# EAGLE design FATSC-DevKit_v10 (EAGLE 7.7.0)
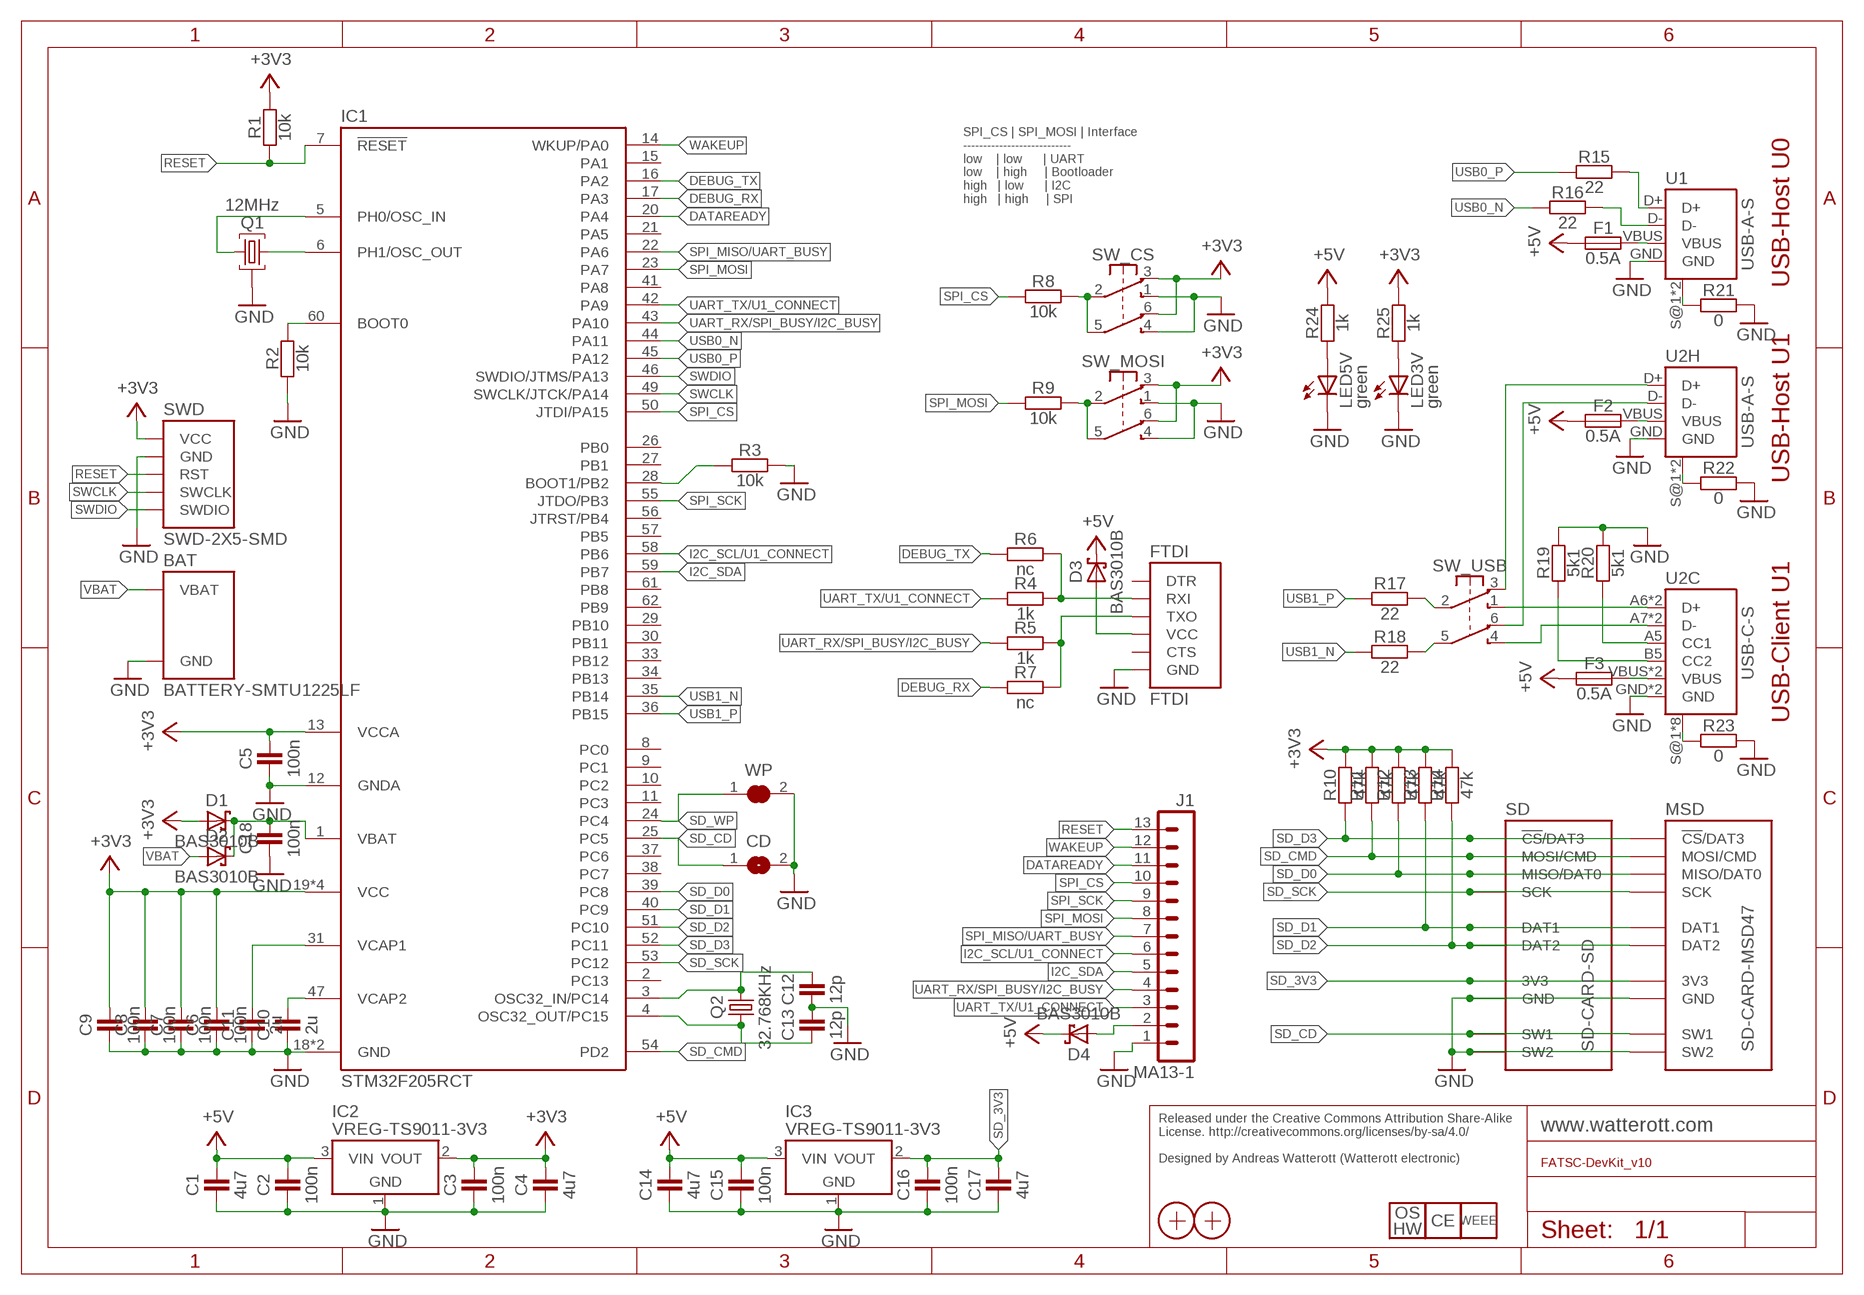
[diagram p0: schematic, sheet 1]

## Parts
BAT  BATTERY-SMTU1225LF  [BAT-SMTU1225LF]
C1  4u7  CAPACITOR-0603  [C0603]
C2  100n  CAPACITOR-0603  [C0603]
C3  100n  CAPACITOR-0603  [C0603]
C4  4u7  CAPACITOR-0603  [C0603]
C5  100n  CAPACITOR-0603  [C0603]
C6  100n  CAPACITOR-0603  [C0603]
C7  100n  CAPACITOR-0603  [C0603]
C8  100n  CAPACITOR-0603  [C0603]
C9  100n  CAPACITOR-0603  [C0603]
C10  2u  CAPACITOR-0603  [C0603]
C11  2u  CAPACITOR-0603  [C0603]
C12  12p  CAPACITOR-0603  [C0603]
C13  12p  CAPACITOR-0603  [C0603]
C14  4u7  CAPACITOR-0603  [C0603]
C15  100n  CAPACITOR-0603  [C0603]
C16  100n  CAPACITOR-0603  [C0603]
C17  4u7  CAPACITOR-0603  [C0603]
C18  100n  CAPACITOR-0603  [C0603]
CD  JUMPER2-0603-NC  [JUMPER2-0603_NC]
D1  BAS3010B  D_SCHOTTKY-SOD323  [SOD323]
D2  BAS3010B  D_SCHOTTKY-SOD323  [SOD323]
D3  BAS3010B  D_SCHOTTKY-SOD323  [SOD323]
D4  BAS3010B  D_SCHOTTKY-SOD323  [SOD323]
F1  0.5A  FUSE-0805  [C0805]
F2  0.5A  FUSE-0805  [C0805]
F3  0.5A  FUSE-0805  [C0805]
FTDI  FTDI  [FTDI]
IC1  STM32F205RCT  [LQFP64]
IC2  VREG-TS9011-3V3  [SOT23]
IC3  VREG-TS9011-3V3  [SOT23]
J1  MA13-1  [MA13-1]
LED3V  green  LED-0603  [C0603]
LED5V  green  LED-0603  [C0603]
LOGO7  LOGO_OSHW-4  [OSHW_4MM]
LOGO8  LOGO_CE-2  [CE_2MM]
LOGO9  LOGO_WEEE-4  [WEEE_4MM]
MSD  SD-CARD-MSD47  [SD_47309XXXX]
Q1  12MHz  CRYSTAL-RES-32  [CRYSTAL_32X13]
Q2  32.768KHz  CRYSTAL-ZM315  [CRYSTAL_ZM315]
R1  10k  RESISTOR-0603  [C0603]
R2  10k  RESISTOR-0603  [C0603]
R3  10k  RESISTOR-0603  [C0603]
R4  1k  RESISTOR-0603  [C0603]
R5  1k  RESISTOR-0603  [C0603]
R6  nc  RESISTOR-0603  [C0603]
R7  nc  RESISTOR-0603  [C0603]
R8  10k  RESISTOR-0603  [C0603]
R9  10k  RESISTOR-0603  [C0603]
R10  47k  RESISTOR-0603  [C0603]
R11  47k  RESISTOR-0603  [C0603]
R12  47k  RESISTOR-0603  [C0603]
R13  47k  RESISTOR-0603  [C0603]
R14  47k  RESISTOR-0603  [C0603]
R15  22  RESISTOR-0603  [C0603]
R16  22  RESISTOR-0603  [C0603]
R17  22  RESISTOR-0603  [C0603]
R18  22  RESISTOR-0603  [C0603]
R19  5k1  RESISTOR-0603  [C0603]
R20  5k1  RESISTOR-0603  [C0603]
R21  0  RESISTOR-0603  [C0603]
R22  0  RESISTOR-0603  [C0603]
R23  0  RESISTOR-0603  [C0603]
R24  1k  RESISTOR-0603  [C0603]
R25  1k  RESISTOR-0603  [C0603]
SD  SD-CARD-SD  [SD_SDBMF00915B0T2]
SW_CS  SW-2UM-CUS22B  [CUS22B]
SW_MOSI  SW-2UM-CUS22B  [CUS22B]
SW_USB  SW-2UM-CUS22B  [CUS22B]
SWD  SWD-2X5-SMD  [SWD-2X5_SMD]
U1  USB-A-S  [USB-A-S]
U2C  USB-C-S  [USB-C-S]
U2H  USB-A-S  [USB-A-S]
WP  JUMPER2-0603  [JUMPER2-0603]
X1  PASSER-07  [PASSER_07MM]
X2  PASSER-07  [PASSER_07MM]

## Nets
5VIN: D4.A J1.2
+3V3: C3.2 C4.2 C5.2 C6.2 C7.2 C8.2 C9.2 D1.A IC1.13(VCCA) IC1.19(VCC) IC1.32(VCC) IC1.48(VCC) IC1.64(VCC) IC2.2(VOUT) R1.2 R10.2 R11.2 R12.2 R13.2 R14.2 R25.2 SW_CS.3(NC1) SW_CS.6(NC2) SW_MOSI.3(NC1) SW_MOSI.6(NC2) SWD.VCC
+5V: C1.2 C2.2 C14.2 C15.2 D3.C D4.C F1.1 F2.1 F3.1 IC2.3(VIN) IC3.3(VIN) R24.2
BOOT0: IC1.60(BOOT0) R2.2
BOOT1: IC1.28(BOOT1/PB2) R3.1
CC1: R20.1 U2C.A5(CC1)
CC2: R19.1 U2C.B5(CC2)
CS: R8.2 SW_CS.2(C1) SW_CS.5(C2)
D0_N: R16.2 U1.D-
D0_P: R15.2 U1.D+
D1_N: R18.2 SW_USB.5(C2)
D1_P: R17.2 SW_USB.2(C1)
D1C_N: SW_USB.4(NO2) U2C.A7(D-) U2C.B7(D-)
D1C_P: SW_USB.1(NO1) U2C.A6(D+) U2C.B6(D+)
D1H_N: SW_USB.6(NC2) U2H.D-
D1H_P: SW_USB.3(NC1) U2H.D+
DATAREADY: IC1.20(PA4) J1.11
DEBUG_RX: IC1.17(PA3) R7.1
DEBUG_TX: IC1.16(PA2) R6.1
FTDI_VCC: D3.A FTDI.3-VCC(VCC)
GND: BAT.-(GND) C1.1 C2.1 C3.1 C4.1 C5.1 C6.1 C7.1 C8.1 C9.1 C10.1 C11.1 C12.1 C13.2 C14.1 C15.1 C16.1 C17.1 C18.1 CD.2 FTDI.1-GND(GND) IC1.12(GNDA) IC1.18(GND) IC1.63(GND) IC2.1(GND) IC3.1(GND) J1.1 LED3V.C LED5V.C MSD.GND MSD.GND@1(GND) MSD.GND@2(GND) MSD.SW2 Q1.GND R2.1 R3.2 R19.2 R20.2 R21.2 R22.2 R23.2 SD.GND@1(GND) SD.GND@2(GND) SD.GND@3(GND) SD.SW2 SW_CS.1(NO1) SW_CS.4(NO2) SW_MOSI.1(NO1) SW_MOSI.4(NO2) SWD.GND@1(GND) SWD.GND@2(GND) SWD.GND@3(GND) U1.GND U2C.GND U2C.GND2(GND) U2H.GND WP.2
I2C_SCL/U1_CONNECT: IC1.58(PB6) J1.6
I2C_SDA: IC1.59(PB7) J1.5
MOSI: R9.2 SW_MOSI.2(C1) SW_MOSI.5(C2)
N$1: LED5V.A R24.1
N$2: LED3V.A R25.1
OSC32I: C12.2 IC1.3(OSC32_IN/PC14) Q2.2
OSC32O: C13.1 IC1.4(OSC32_OUT/PC15) Q2.1
OSCI: IC1.5(PH0/OSC_IN) Q1.2
OSCO: IC1.6(PH1/OSC_OUT) Q1.1
RESET: IC1.7(!RESET) J1.13 R1.1 SWD.RST
RXI: FTDI.5-RXI(RXI) R4.2 R6.2
SD_3V3: C16.2 C17.2 IC3.2(VOUT) MSD.VCC(3V3) SD.VCC(3V3)
SD_CD: CD.1 IC1.25(PC5) MSD.SW1 SD.SW1
SD_CMD: IC1.54(PD2) MSD.MOSI(MOSI/CMD) R11.1 SD.MOSI(MOSI/CMD)
SD_D0: IC1.39(PC8) MSD.MISO(MISO/DAT0) R12.1 SD.MISO(MISO/DAT0)
SD_D1: IC1.40(PC9) MSD.DAT1 R13.1 SD.DAT1
SD_D2: IC1.51(PC10) MSD.DAT2 R14.1 SD.DAT2
SD_D3: IC1.52(PC11) MSD.CS(!CS!/DAT3) R10.1 SD.CS(!CS!/DAT3)
SD_SCK: IC1.53(PC12) MSD.SCK SD.SCK
SD_WP: IC1.24(PC4) WP.1
SPI_CS: IC1.50(JTDI/PA15) J1.10 R8.1
SPI_MISO/UART_BUSY: IC1.22(PA6) J1.7
SPI_MOSI: IC1.23(PA7) J1.8 R9.1
SPI_SCK: IC1.55(JTDO/PB3) J1.9
SU0: R21.1 U1.S@1(SHIELD) U1.S@2(SHIELD)
SU1C: R23.1 U2C.S@1(SHIELD) U2C.S@2(SHIELD) U2C.S@3(SHIELD) U2C.S@4(SHIELD) U2C.S@5(SHIELD) U2C.S@6(SHIELD) U2C.S@7(SHIELD) U2C.S@8(SHIELD)
SU1H: R22.1 U2H.S@1(SHIELD) U2H.S@2(SHIELD)
SWCLK: IC1.49(SWCLK/JTCK/PA14) SWD.SWCLK
SWDIO: IC1.46(SWDIO/JTMS/PA13) SWD.SWDIO
TXO: FTDI.4-TXO(TXO) R5.2 R7.2
UART_RX/SPI_BUSY/I2C_BUSY: IC1.43(PA10) J1.4 R5.1
UART_TX/U1_CONNECT: IC1.42(PA9) J1.3 R4.1
USB0_N: IC1.44(PA11) R16.1
USB0_P: IC1.45(PA12) R15.1
USB1_N: IC1.35(PB14) R18.1
USB1_P: IC1.36(PB15) R17.1
VB: C18.2 D1.C D2.C IC1.1(VBAT)
VBAT: BAT.+(VBAT) D2.A
VBUS_U0: F1.2 U1.VBUS
VBUS_U1C: F3.2 U2C.VBUS U2C.VBUS2(VBUS)
VBUS_U1H: F2.2 U2H.VBUS
VCAP1: C11.2 IC1.31(VCAP1)
VCAP2: C10.2 IC1.47(VCAP2)
WAKEUP: IC1.14(WKUP/PA0) J1.12
Unconnected: FTDI.2-CTS(CTS) FTDI.6-DTR(DTR) IC1.2(PC13) IC1.8(PC0) IC1.9(PC1) IC1.10(PC2) IC1.11(PC3) IC1.15(PA1) IC1.21(PA5) IC1.26(PB0) IC1.27(PB1) IC1.29(PB10) IC1.30(PB11) IC1.33(PB12) IC1.34(PB13) IC1.37(PC6) IC1.38(PC7) IC1.41(PA8) IC1.56(JTRST/PB4) IC1.57(PB5) IC1.61(PB8) IC1.62(PB9)

## Notes on the sheet
- SPI_CS | SPI_MOSI | Interface
  ---------------------------
  low    | low      | UART
  low    | high     | Bootloader
  high   | low      | I2C
  high   | high     | SPI
- USB-Host U0
- USB-Host U1
- USB-Client U1
- Released under the Creative Commons Attribution Share-Alike 
  License. http://creativecommons.org/licenses/by-sa/4.0/
  
  Designed by Andreas Watterott (Watterott electronic)

## Library data of the parts
BAT = we-power:BATTERY: Battery Holder
C1-C18 = we-rcl:CAPACITOR: Capacitor ...2.2uF @ 6.3V -> 0402 ...4.7uF @ 6.3V -> 0603 ...10uF @ 16V -> 0805 ...22uF @ 25V -> 1206
CD WP = we-rcl:JUMPER2: 2-Pin Jumper
D1-D4 = we-rcl:D_SCHOTTKY: Schottky Diode 1A, 30V - SOD323 (BAS3010B) 3A, 100V - SOD123 (S310A)
F1-F3 = we-rcl:FUSE: Fuse Polyfuses 0805 - 0.5A or 1A, 6V 1206 - 2A, 6V 1812 - 1A or 2A, 16V
FTDI = we-board:FTDI: FTDI 6pol connector
IC1 = we-chip:STM32F205R: ST STM32F205 ARM Microcontroller B = 128 KB Flash / 64 KB RAM C = 256 KB Flash / 96 KB RAM E = 512 KB Flash / 128 KB RAM F = 768 KB Flash / 128 KB RAM G = 1024 KB Flash / 128 KB RAM
IC2 IC3 = we-power:VREG: Voltage Regulator LDOs Taiwan Semi TS1117 800mA max 15V - compatible On Semi NCP1117 1A max 20V - compatible Diodes AP2111H 0.6A max 6V (0.25V@0.6A) - compatible Diodes AP2114H 1A max 6V (0.45V@1A) Taiwan Semi TS9011 250mA max 12V - compatible Diodes AP2210 300mA max 15V - compatible Microchip MCP1700 250mA max 6.5V - compatible Microchip MCP1702 250mA max 13V - compatible Microchip MCP1703 250mA max 16V - compatible Microchip MCP1754 150mA max 16V Taiwan Semi TS5204 80mA max 16V (low noise) DC/DC Converter Modules Recom R-78Ex.x-1.0-W36 1A max 28V - compatible CUI V78xx-2000 2A max 18V Murata OKI-78SR-x.x/1.5-W36 1.5A max 36V
J1 = we-con:MA13-1: Pin Header
LED3V LED5V = we-opto:LED: LED red, green, blue -> 0603
LOGO7 = we-symbol:LOGO_OSHW: Open-Source-Hardware Logo
LOGO8 = we-symbol:LOGO_CE: CE Logo
LOGO9 = we-symbol:LOGO_WEEE: WEEE Logo
MSD SD = we-con:SD-CARD: SD-Card Socket
Q1 = we-rcl:CRYSTAL-RES: Crystal Resonator Murata CSTCR (Size: 4.5mm x 2.0mm) Tolerance: 0.5% 4MHz 15pF CST-CR-4M00-G53 4MHz 39pF CST-CR-4M00-G55 Tolerance: 0.1% 4MHz 39pF CST-CR-4M00-G15 Murata CSTNE (Size: 3.2mm x 1.3mm) Tolerance: 0.5% 8MHz 33pF CST-NE-8M00-G55 12MHz 33pF CST-NE-12M0-G55 16MHz 15pF CST-NE-16M0-V53 20MHz 15pF CST-NE-20M0-V53 Tolerance: 0.1% 8MHz 33pF CST-NE-8M00-G15 12MHz 33pF CST-NE-12M0-G15 16MHz 15pF CST-NE-16M0-V13 20MHz 15pF CST-NE-20M0-V13
Q2 = we-rcl:CRYSTAL: Crystal
R1-R25 = we-rcl:RESISTOR: Resistor all kinds in 0402 and 0603
SW_CS SW_MOSI SW_USB = we-switch:SW-2UM: Switch; DIGIKEY: 563-1105-6-ND
SWD = we-board:SWD: SWD connector
U1 U2H = we-con:USB: USB Connector
U2C = we-con:USB-C: USB-C Connector Hroparts TYPE-C-31-M-12 or Jing C167321 or XKB U262-161N-4BVC11 Up: XKB U263-241N-4BQC11-1 or Wuerth 632722110112
X1 X2 = we-symbol:PASSER: Fiducial Marker

## Board
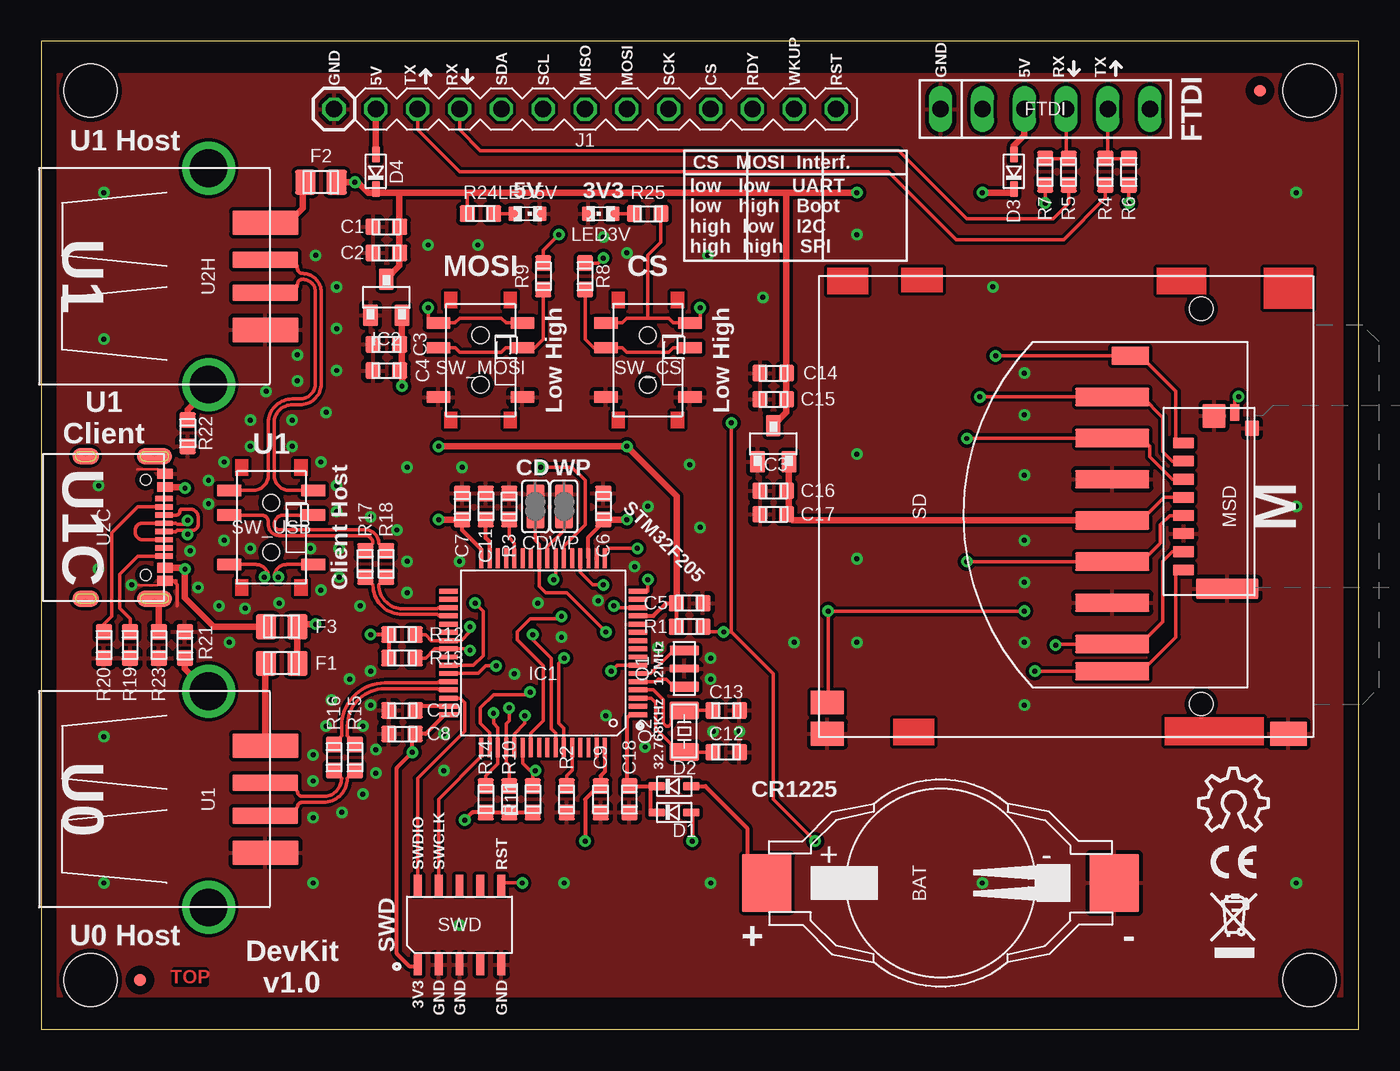
[diagram p1: board, top side]
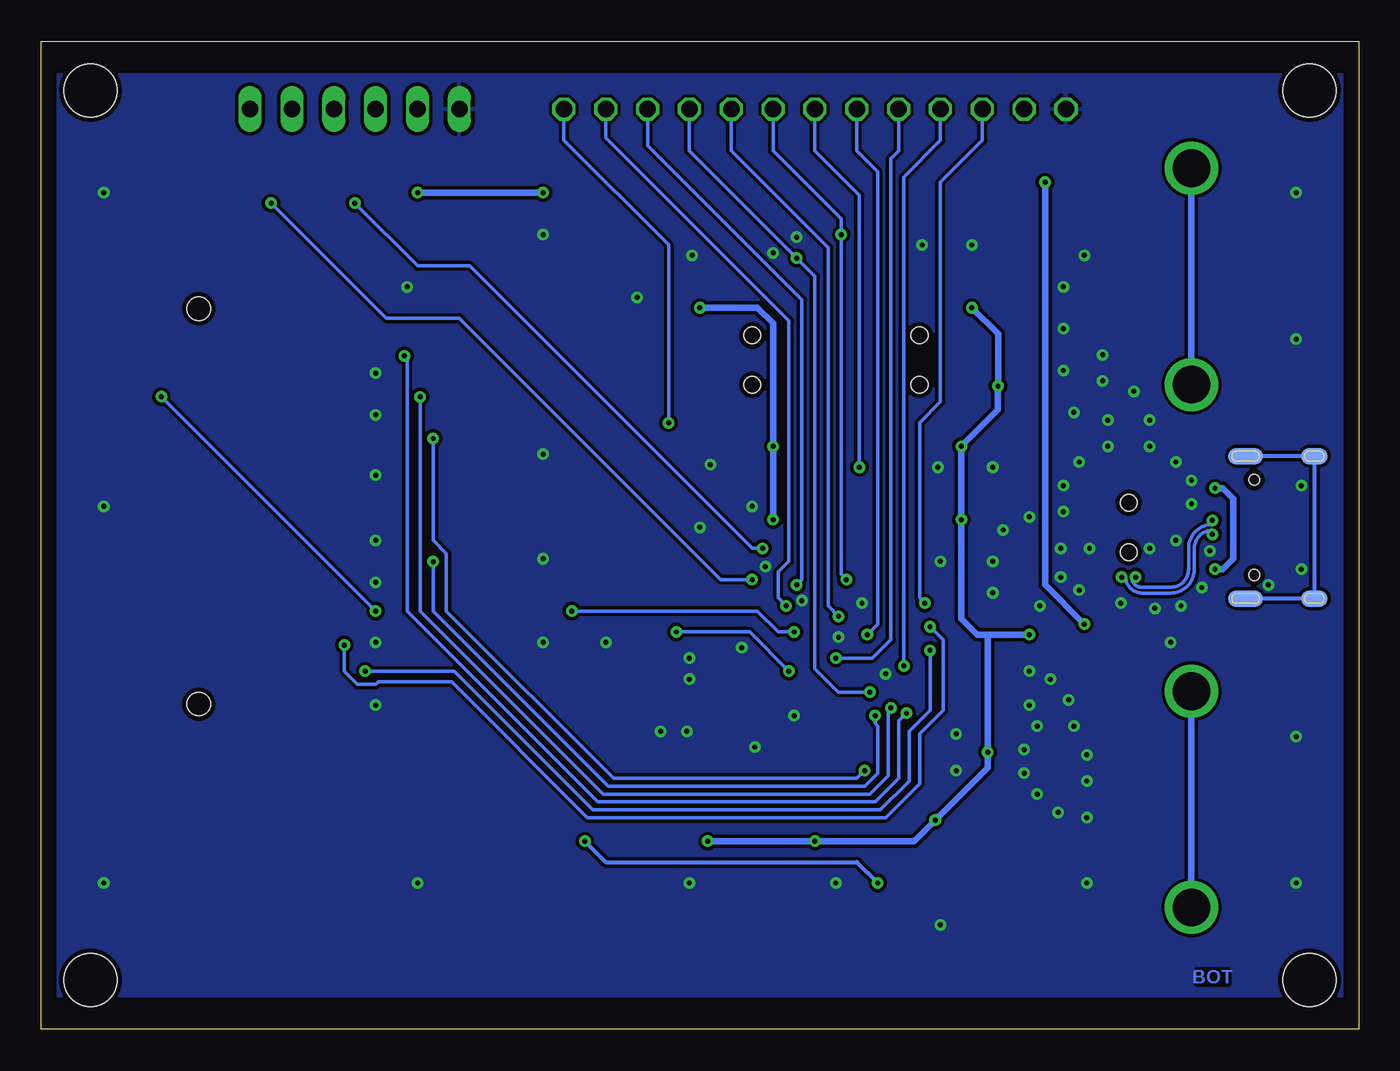
[diagram p2: board, bottom side, seen from below]

Size 80 x 60 mm. Coordinates in mm from the lower left corner, seen from the top.
Outline: 0,0 80,0 80,60 0,60 0,0
Copper layers (1*16): Top 0.035mm / dielectric 1.5mm / Bottom 0.035mm
Design rules "we-dru-2-layer *": minimum track width 0.15mm, minimum drill 0.3mm, track to track 0.15mm, track to pad 0.15mm, pad to pad 0.15mm, via to via 0.15mm, smd to smd 0.1mm, copper to edge 0.3mm, drill to drill 0.2mm, minimum pad ring 0.18mm, minimum via ring 0.2mm, stop-mask expansion 0.1mm, vias tented up to drill 0.5mm, thermal gap 0.25mm
Holes 3.2 mm at 3,3 77,3 3,57 77,57

### Footprints (pad centres in the part's own frame; a part is rotated, then mirrored left to right if it is on the bottom)
BAT-SMTU1225LF = smd 3.5 x 3: + 0,10.55; - 0,-10.55
C0603 = smd 1 x 0.95: 1 0,0.8; 2 0,-0.8
JUMPER2-0603_NC = smd 1.1 x 1.2: 1 0,0.75; 2 0,-0.75
SOD323 = smd 0.5 x 1: A 0,-1.05; C 0,1.05
C0805 = smd 1.5 x 1.25: 1 0,0.95; 2 0,-0.95
FTDI = drill 1 long: 1-GND 0,6.35; 2-CTS 0,3.81; 3-VCC 0,1.27; 4-TXO 0,-1.27; 5-RXI 0,-3.81; 6-DTR 0,-6.35
LQFP64 = smd 1.2 x 0.3: 1 -5.75,3.75; 2 -5.75,3.25; 3 -5.75,2.75; 4 -5.75,2.25; 5 -5.75,1.75; 6 -5.75,1.25; 7 -5.75,0.75; 8 -5.75,0.25; 9 -5.75,-0.25; 10 -5.75,-0.75; 11 -5.75,-1.25; 12 -5.75,-1.75; 13 -5.75,-2.25; 14 -5.75,-2.75; 15 -5.75,-3.25; 16 -5.75,-3.75; 33 5.75,-3.75; 34 5.75,-3.25; 35 5.75,-2.75; 36 5.75,-2.25; 37 5.75,-1.75; 38 5.75,-1.25; 39 5.75,-0.75; 40 5.75,-0.25; 41 5.75,0.25; 42 5.75,0.75; 43 5.75,1.25; 44 5.75,1.75; 45 5.75,2.25; 46 5.75,2.75; 47 5.75,3.25; 48 5.75,3.75 | smd 0.3 x 1.2: 17 -3.75,-5.75; 18 -3.25,-5.75; 19 -2.75,-5.75; 20 -2.25,-5.75; 21 -1.75,-5.75; 22 -1.25,-5.75; 23 -0.75,-5.75; 24 -0.25,-5.75; 25 0.25,-5.75; 26 0.75,-5.75; 27 1.25,-5.75; 28 1.75,-5.75; 29 2.25,-5.75; 30 2.75,-5.75; 31 3.25,-5.75; 32 3.75,-5.75; 49 3.75,5.75; 50 3.25,5.75; 51 2.75,5.75; 52 2.25,5.75; 53 1.75,5.75; 54 1.25,5.75; 55 0.75,5.75; 56 0.25,5.75; 57 -0.25,5.75; 58 -0.75,5.75; 59 -1.25,5.75; 60 -1.75,5.75; 61 -2.25,5.75; 62 -2.75,5.75; 63 -3.25,5.75; 64 -3.75,5.75
SOT23 = smd 1.3 x 0.9: 1 -1.1,0.95; 2 -1.1,-0.95; 3 1.1,0
MA13-1 = drill 1 octagon: 1 0,15.24; 2 0,12.7; 3 0,10.16; 4 0,7.62; 5 0,5.08; 6 0,2.54; 7 0,0; 8 0,-2.54; 9 0,-5.08; 10 0,-7.62; 11 0,-10.16; 12 0,-12.7; 13 0,-15.24
C0603' = smd 0.9 x 0.8: A 0,-0.75; C 0,0.75
SD_47309XXXX = smd 0.65 x 1.3: CS 2.75,4.3; DAT1 -3.85,4.3; DAT2 3.85,4.3; GND -1.65,4.3; MISO -2.75,4.3; MOSI 1.65,4.3; SCK -0.55,4.3; VCC 0.55,4.3 | smd 1.2 x 3.8: GND@1 -5,1.65 | smd 1.45 x 1.4: GND@2 5.5,2.45 | smd 1 x 0.6: SW1 5.7,1.2 | smd 0.95 x 0.85: SW2 4.75,0.15
CRYSTAL_32X13 = smd 1.8 x 0.6: 1 0,1.1; 2 0,-1.1 | smd 1.8 x 0.5: GND 0,0
CRYSTAL_ZM315 = smd 1.8 x 1.1: 1 0,1.25; 2 0,-1.25
SD_SDBMF00915B0T2 = smd 1.1 x 4.5: CS -6.65,2.8; DAT1 10,2.8; GND@1 -1.65,2.8; GND@2 5.85,2.8; MISO 8.35,2.8; MOSI -4.15,2.8; SCK 3.35,2.8; VCC 0.85,2.8 | smd 1.1 x 2.3: DAT2 -9.15,3.9 | smd 1.45 x 2.2: GND@3 13.8,13.5 | smd 1.4 x 2: SW1 11.9,-14.5 | smd 1.45 x 2: SW2 13.8,-14.5 | hole 1.4: 12,8.2; -12,8.2
CUS22B = smd 0.7 x 1.5: 1 -2.25,2.55; 2 0.75,2.55; 3 2.25,2.55; 4 -2.25,-2.55; 5 0.75,-2.55; 6 2.25,-2.55 | hole 1: -1.5,0; 1.5,0
SWD-2X5_SMD = smd 1.27 x 0.533: GND@1 -2.413,1.27; GND@2 -2.413,0; GND@3 -2.413,-2.54; NC@1 -2.413,-1.27; NC@2 2.413,-1.27; RST 2.413,-2.54; SWCLK 2.413,1.27; SWDIO 2.413,2.54; SWO 2.413,0; VCC -2.413,2.54
USB-A-S = smd 4 x 1: D+ -3.45,1; D- -3.45,-1 | smd 4 x 1.5: GND -3.45,3.25; VBUS -3.45,-3.25 | drill 2.3: S@1 0,6.566; S@2 0,-6.566
USB-C-S = smd 1.1 x 0.3: A5 -1.105,-1.25; A6 -1.105,-0.25; A7 -1.105,0.25; A8 -1.105,1.25; B5 -1.105,1.75; B6 -1.105,0.75; B7 -1.105,-0.75; B8 -1.105,-1.75 | smd 1 x 0.6: GND -1.155,3.25; GND2 -1.155,-3.25; VBUS -1.155,2.45; VBUS2 -1.155,-2.45 | smd 2.1 x 1: S@1 -0.53,4.32; S@5 -0.53,-4.32 | smd 2.1 x 1 bottom: S@2 -0.53,4.32; S@6 -0.53,-4.32 | smd 1.6 x 1: S@3 3.65,4.32; S@7 3.65,-4.32 | smd 1.6 x 1 bottom: S@4 3.65,4.32; S@8 3.65,-4.32 | hole 0.65: 0,-2.89; 0,2.89
JUMPER2-0603 = smd 1.1 x 1.2: 1 0,0.75; 2 0,-0.75
PASSER_07MM = smd 0.7 x 0.7: X 0,0

### Placement (x,y rotation side)
BAT  54.61,8.89 90 top
C1  20.95,48.74 90 top
C2  20.95,47.15 90 top
C3  20.95,41.59 90 top
C4  20.95,40.01 90 top
C5  39.37,25.88 270 top
C6  34.13,31.75 0 top
C7  25.56,31.75 0 top
C8  21.91,17.94 90 top
C9  33.97,13.97 180 top
C10  21.91,19.37 90 top
C11  26.99,31.75 0 top
C12  41.59,16.83 270 top
C13  41.59,19.37 90 top
C14  44.45,39.85 90 top
C15  44.45,38.26 90 top
C16  44.45,32.7 90 top
C17  44.45,31.27 90 top
C18  35.72,13.97 180 top
CD  30,31.75 180 top
D1  38.42,13.18 90 top
D2  38.42,14.76 90 top
D3  59.05,52.07 180 top
D4  20.32,52.07 180 top
F1  14.61,22.23 270 top
F2  16.99,51.44 270 top
F3  14.61,24.45 270 top
FTDI  60.96,55.88 90 top
IC1  30.48,22.86 180 top
IC2  20.95,44.45 90 top
IC3  44.45,35.56 90 top
J1  33.02,55.88 90 top
LED3V  green  [C0603']  33.97,49.53 90 top
LED5V  green  [C0603']  29.53,49.53 270 top
LOGO7  72.39,13.97 0 top
LOGO8  72.39,10.16 0 top
LOGO9  72.39,6.35 0 top
MSD  73.66,31.75 90 top
Q1  39.05,21.91 0 top
Q2  39.05,18.1 0 top
R1  39.37,24.45 270 top
R2  31.91,13.97 180 top
R3  28.42,31.75 180 top
R4  64.61,52.07 180 top
R5  62.39,52.07 180 top
R6  66.04,52.07 180 top
R7  60.96,52.07 180 top
R8  33.02,45.72 0 top
R9  30.48,45.72 0 top
R10  28.42,13.97 0 top
R11  29.84,13.97 0 top
R12  21.91,23.97 270 top
R13  21.91,22.54 270 top
R14  26.99,13.97 0 top
R15  19.05,16.51 0 top
R16  17.78,16.51 0 top
R17  19.68,28.26 180 top
R18  20.95,28.26 180 top
R19  5.4,23.34 0 top
R20  3.81,23.34 0 top
R21  8.73,23.34 180 top
R22  8.89,36.2 0 top
R23  7.14,23.34 0 top
R24  26.67,49.53 270 top
R25  36.83,49.53 90 top
SD  62.23,31.75 270 top
SW_CS  36.83,40.64 90 top
SW_MOSI  26.67,40.64 90 top
SW_USB  13.97,30.48 90 top
SWD  25.4,6.35 90 top
U1  10.16,13.97 180 top
U2C  6.35,30.48 180 top
U2H  10.16,45.72 180 top
WP  31.75,31.75 180 top
X1  6,3 0 top
X2  74,57 0 top

### Tracks (layer width: path | path; a pad name or v marks a point on that pad's centre or on a via)
5VIN
  Top 0.406: J1.2 D4.A
+3V3  (via drill 0.3)
  Top 0.203: SW_CS.3 35.27,42.89 35.56,43.18 36.83,43.18 | 36.83,43.18 38.1,43.18 38.39,42.89 SW_CS.6 39.38,42.87 39.37,42.86 39.69,42.86 40.01,43.18 v40.01,43.81 | SW_MOSI.6 28.23,42.89 27.94,43.18 25.4,43.18 25.11,42.89 SW_MOSI.3 23.79,42.89 23.5,43.18 v23.5,43.81 | IC1.48 24.51,19.11 | C5.2 | 22.54,17.77 C8.2 | v25.72,12.69 v25.72,12.7 | 34.28,30.8 C6.2 | R25.2 37.63,47.79 36.83,46.99 36.83,43.18 | C4.2 21.91,40.01 | SWD.VCC 22.86,3.81 | C9.2 33.82,14.77 | D1.A 39.53,13.18 | 34.61,30.96 C6.2
  Top 0.254: 24.51,19.11 23.34,17.94 C8.2 | IC1.32 26.73,29.15 25.56,30.32 C7.2 | R1.2 C5.2 37.94,25.88 37.17,25.11 IC1.13 | IC1.64 34.23,15.66 33.97,15.4 C9.2 | R11.2 R10.2 R14.2 26.19,13.17 v25.72,12.7 | R13.2 R12.2 v20,23.97 | 22.54,17.77 v22.54,16.83 21.59,15.88 21.59,4.6 22.38,3.81 22.86,3.81 | IC1.19 33.23,29.9 34.13,30.8 C6.2 | 33.82,14.77 33.02,13.97 v33.02,11.43 | 39.53,13.18 v39.53,11.43
  Top 0.406: v24.13,35.4 v35.56,35.4 38.58,32.38 C5.2 | IC2.2 21.91,41.59 | 21.91,41.59 21.91,40.16 C4.2 | C3.2 21.91,41.59 | 21.91,40.01 v21.91,39.05 | v35.56,30.96 34.61,30.96 | C7.2 v24.14,30.95 v24.13,30.96
  Bottom 0.203: v23.5,43.81 v23.49,43.81 | v21.91,39.05
  Bottom 0.406: 22.54,23.97 v22.54,16.83 22.54,15.88 v25.72,12.7 26.99,11.43 v33.02,11.43 v39.53,11.43 | v24.13,30.94 24.13,24.92 23.18,23.97 22.54,23.97 | 22.54,23.97 v20,23.97 | v21.91,39.05 21.91,37.62 v24.13,35.4 v24.13,30.94 | v40.01,43.81 36.51,43.81 35.56,42.86 v35.56,35.4 v35.56,30.96 | v23.49,43.81 21.91,42.23 v21.91,39.05 | v24.13,30.94 v24.14,30.95
+5V  (via drill 0.3)
  Top 0.203: R24.2 25.87,50.63 26.04,50.8
  Top 0.406: F1.1 F3.1 15.71,24.61 v16.67,24.61 | IC3.3 45.25,37.46 C15.2 C14.2 45.24,50.8 | F2.1 v19.05,51.44 19.21,51.44 19.84,50.8 20.1,50.8 D4.C 20.32,50.8 21.75,50.8 | 21.75,50.8 C1.2 C2.2 21.75,46.35 IC2.3 | 45.24,50.8 26.04,50.8 21.75,50.8 | D3.C 59.05,50.8 v57.15,50.8 | v49.53,50.8 45.24,50.8
  Bottom 0.406: v19.05,51.44 19.05,26.99 v16.67,24.61 | v57.15,50.8 v49.53,50.8
BOOT0
  Top 0.203: IC1.60 32.23,15.72 31.91,15.4 R2.2
BOOT1
  Top 0.203: IC1.28 28.73,29.53 28.42,29.84 R3.1
CC1
  Top 0.203: U2C.A5 5.85,31.73 4.29,30.16 4.29,25.08 3.81,24.61 R20.1
CC2
  Top 0.203: U2C.B5 5.87,28.73 4.76,27.62 4.76,25.56 5.4,24.92 R19.1
CS
  Top 0.203: SW_CS.5 38.37,41.39 38.1,41.12 35.56,41.12 35.29,41.39 SW_CS.2 33.54,41.39 33.02,41.91 R8.2
D0_N
  Top 0.203: R16.2 17.78,15.7 18.24,15.24 arc-90 17.14,14.15 15.86,14.15 arc-90 15.56,14.45 15.03,14.97 U1.D-
D0_P
  Top 0.203: R15.2 19.05,15.7 18.59,15.24 arc-90 17.14,13.79 15.86,13.79 arc90 15.56,13.49 15.03,12.97 U1.D+
D1_N
  Top 0.203: SW_USB.5 14.72,31.23 arc90 14.15,30.66 14.15,30.64 arc90 14.45,30.34 19.68,30.34 arc-90 20.5,29.53 R18.2
D1_P
  Top 0.203: SW_USB.2 13.36,31.23 arc-90 13.79,30.8 13.79,30.64 arc90 14.45,29.99 19.68,29.99 arc-90 20.14,29.53 20.14,29.52 R17.2
D1C_N  (via drill 0.3)
  Top 0.203: SW_USB.4 14.91,28.23 arc90 14.15,27.46 v14.39,27.46 | 8.89,30.3 v8.89,30.05 | 8.89,30.3 8.26,30.3 8.18,30.23 U2C.A7 | U2C.B7 8.21,31.23 arc90 8.41,31.43 arc-90 8.57,31.59 9.05,31.59 arc-90 9.53,31.11 9.53,30.64 arc-90 9.19,30.3 8.89,30.3
  Bottom 0.203: v14.39,27.46 14.15,27.46 arc-90 13.18,26.49 11.43,26.49 arc-90 9.98,27.94 9.98,29.21 arc90 8.89,30.3 v8.89,30.05
D1C_P  (via drill 0.3)
  Top 0.203: SW_USB.1 13.03,28.23 arc-90 13.79,27.46 v13.54,27.46 | v8.89,30.91 8.89,30.66 8.26,30.66 8.18,30.73 U2C.A6 6.12,30.73 arc90 5.71,30.32 5.71,30.16 arc90 6.15,29.73 U2C.B6
  Bottom 0.203: v13.54,27.46 13.79,27.46 arc-90 13.18,26.85 11.43,26.85 arc-90 10.34,27.94 10.34,29.21 arc90 8.89,30.66 v8.89,30.91
D1H_N
  Top 0.203: U2H.D- 15.19,46.72 15.56,46.35 15.56,46.21 arc90 15.88,45.9 arc-90 17,44.77 17,39.21 arc-90 15.72,37.92 15.24,37.92 arc90 14.15,36.83 14.15,33.66 arc90 15.07,32.73 SW_USB.6
D1H_P
  Top 0.15: U2H.D+ 15.19,44.72 15.56,45.09
  Top 0.203: 15.56,45.09 15.56,45.23 arc-90 15.88,45.54 arc-90 16.65,44.77 16.65,39.21 arc-90 15.72,38.28 15.24,38.28 arc90 13.79,36.83 13.79,33.66 arc-90 12.87,32.73 SW_USB.3
DATAREADY  (via drill 0.3)
  Top 0.203: IC1.20 32.73,27.75 33.5,26.99 v34.13,26.99
  Bottom 0.203: v34.13,26.99 33.81,27.3 33.81,44.29 43.18,53.66 J1.11
DEBUG_RX  (via drill 0.3)
  Top 0.203: v60.96,50.16 R7.1 | v36.2,29.21 34.45,29.21 34.23,28.99 IC1.17
  Bottom 0.203: v36.2,29.21 36.83,29.21 53.98,46.35 57.15,46.35 v60.96,50.16
DEBUG_TX  (via drill 0.3)
  Top 0.203: R6.1 v66.04,50.16 | IC1.16 36.83,26.61 v36.83,27.3
  Bottom 0.203: v36.83,27.3 38.73,27.3 54.61,43.18 59.05,43.18 v66.04,50.16
FTDI_VCC
  Top 0.406: FTDI.3-VCC 59.69,54.29 59.05,53.66 D3.A
GND  (via drill 0.3)
  Top 0.152: 7.08,34 5.84,34 | 7.05,26.96 5.81,26.96
  Top 0.203: 8.26,25.72 8.26,26.99 8.01,27.23 U2C.GND | 8.18,27.23 8.18,27.22
  other vias: 15.56,39.37 9.05,29.05 11.11,29.69 3.49,33.02 3.49,27.94 40.64,22.54 42.39,18.1 40.64,21.27 40.8,18.1 16.67,46.99 17.94,45.09 17.94,42.55 17.94,40.01 17.3,37.47 15.24,36.99 12.7,36.99 12.7,35.4 15.56,40.96 12.38,25.56 9.53,26.83 14.45,25.88 12.7,29.21 11.11,34.45 10.16,31.91 16.99,34.45 17.94,33.02 16.35,29.21 18.1,29.21 18.1,27.46 19.37,25.72 22.23,26.51 22.23,28.42 17.94,31.43 21.59,30.32 16.99,26.67 10.79,25.72 16.51,15.08 16.51,12.86 18.26,13.18 19.53,14.29 20.32,16.99 16.51,16.67 17.3,18.41 19.53,18.41 20.32,15.56 17.62,20 18.73,21.27 20,19.68 20,21.75 15.24,35.4 13.65,38.73 5.49,26.99 36.67,17.14 37.47,23.18 10.16,33.34 25.56,34.13 20,31.11 22.23,34.13 23.5,47.62 26.51,47.62 34.13,48.1 35.56,47.15 40.48,46.99 25.4,28.42 30.16,25.88 34.29,19.05 28.73,21.59 24.45,17.94 24.45,15.72 31.59,23.81 36.04,28.1 36.83,31.75 39.37,34.29 59.69,23.5 59.69,27.15 59.69,29.69 59.69,33.66 59.69,37.31 59.69,39.85 59.69,19.68 76.2,50.8 76.2,31.75 76.2,8.89 3.81,50.8 3.81,41.91 3.81,17.78 3.81,8.89 57.15,8.89 49.53,23.5 49.53,28.57 49.53,34.92 49.53,48.26 57.78,45.09 40.64,8.89 31.75,8.89 16.51,8.89 43.81,44.45 45.72,23.5 11.43,23.5 25.4,6.35 40.01,30.48 33.81,26.04
  pour Top (isolate 0.203, rank 2): 1,58 79,58 79,2 1,2
  pour Bottom (isolate 0.203): 1,58 79,58 79,2 1,2
I2C_SCL/U1_CONNECT  (via drill 0.3)
  Top 0.203: IC1.58 31.23,17.98 30.96,18.26 30.96,22.54 29.84,23.65 v29.84,23.97
  Bottom 0.203: v29.84,23.97 29.21,24.61 29.21,52.07 30.48,53.34 J1.6
I2C_SDA  (via drill 0.3)
  Top 0.203: IC1.59 31.73,18.28 31.43,18.57 31.43,22.23 v31.75,22.54
  Bottom 0.203: v31.75,22.54 29.53,22.54 28.42,23.65 28.42,52.86 27.94,53.34 J1.5
MOSI
  Top 0.203: SW_MOSI.2 25.13,41.39 25.4,41.12 27.94,41.12 28.21,41.39 SW_MOSI.5 29.96,41.39 30.48,41.91 R9.2
N$1
  Top 0.203: LED5V.A R24.1
N$2
  Top 0.203: LED3V.A R25.1
OSC32I
  Top 0.203: IC1.3 37.04,20.11 37.31,19.84 37.31,18.26 38.72,16.85 Q2.2 39.07,16.83 C12.2
OSC32O
  Top 0.203: IC1.4 37.17,20.61 37.78,20 37.78,18.57 37.94,18.41 38.1,18.41 38.26,18.57 38.26,18.89 38.72,19.35 Q2.1 39.07,19.37 C13.1
OSCI
  Top 0.203: IC1.5 37.3,21.11 37.47,21.27 37.94,21.27 38.41,20.81 Q1.2
OSCO
  Top 0.203: IC1.6 37.01,21.61 38.42,23.02 Q1.1
RESET  (via drill 0.3)
  Top 0.203: R1.1 40.48,24.13 v41.43,24.13 41.91,24.13 | IC1.7 34.97,22.11 v34.61,21.75 | v41.91,36.83 41.91,24.13 | 41.91,24.13 44.45,21.59 44.45,13.97 v46.99,11.43 | v29.21,8.89 28.07,8.89 SWD.RST
  Bottom 0.203: v34.61,21.75 36.99,24.13 v41.43,24.13 | J1.13 48.26,53.98 41.91,47.62 v41.91,36.83
  Bottom 0.254: v46.99,11.43 45.72,10.16 30.48,10.16 v29.21,8.89
RXI
  Top 0.203: FTDI.5-RXI 64.77,53.03 R4.2 R6.2
SD_3V3
  Top 0.203: MSD.VCC 68.18,32.3 66.78,30.9 SD.VCC | 45.4,31.42 C17.2 | C16.2 45.4,32.54
  Top 0.406: SD.VCC 45.62,30.9 C17.2 | IC3.2 45.4,32.54 45.4,31.42
SD_CD  (via drill 0.3)
  Top 0.203: CD.1 30,29.69 30.23,29.46 IC1.25 30.23,26.92 30.64,26.51 31.91,26.51 v34.29,24.13 | MSD.SW1 72.46,38.17 v72.71,38.42 | SD.SW1 47.78,19.9 v47.78,25.4 v59.69,25.4
  Bottom 0.203: v72.71,38.42 v59.69,25.4 | v34.29,24.13 35.24,24.13 36.51,25.4 v47.78,25.4
SD_CMD  (via drill 0.3)
  Top 0.203: MSD.MOSI 68.68,33.4 67.31,34.77 67.31,35.4 66.81,35.9 SD.MOSI 56.22,35.9 v56.2,35.88 | IC1.54 29.23,16.17 29.84,15.56 | 29.84,15.56 R11.1 | v30,15.72 29.84,15.56
  Bottom 0.203: v56.2,35.88 56.2,29.69 55.4,28.89 55.4,25.4 45.24,15.24 30.48,15.24 v30,15.72
SD_D0  (via drill 0.3)
  Top 0.203: MSD.MISO 68.69,29 68.1,28.42 68.1,24.77 66.74,23.4 SD.MISO 61.66,23.4 v61.59,23.34 | R12.1 23.34,23.97 23.7,23.61 IC1.39 25.52,23.61 26.04,24.13 v26.04,24.45
  Bottom 0.203: v61.59,23.34 61.59,21.75 60.8,20.95 59.69,20.95 59.53,21.11 55.09,21.11 46.83,12.86 28.73,12.86 26.67,14.92 26.67,17.94 25.24,19.37 25.24,23.65 v26.04,24.45
SD_D1  (via drill 0.3)
  Top 0.203: MSD.DAT1 69.17,27.9 68.9,27.62 68.9,23.81 66.83,21.75 SD.DAT1 v60.33,21.75 | R13.1 23.34,22.54 23.9,23.11 IC1.40 25.94,23.11 v26.04,23.02
  Bottom 0.203: v60.33,21.75 54.93,21.75 46.51,13.34 29.05,13.34 27.3,15.08 27.3,18.1 26.04,19.37 v26.04,23.02
SD_D2  (via drill 0.3)
  Top 0.203: MSD.DAT2 69.24,35.72 69.06,35.72 68.9,35.88 68.9,38.73 66.73,40.9 SD.DAT2 v57.94,40.9 | R14.1 26.99,15.4 27.73,16.14 IC1.51 27.73,18.31 27.46,18.57 v27.46,19.21
  Bottom 0.203: v27.46,19.21 27.94,18.73 27.94,15.24 29.37,13.81 46.2,13.81 57.78,25.4 57.78,40.74 v57.94,40.9
SD_D3  (via drill 0.3)
  Top 0.203: MSD.CS 68.69,34.5 68.1,35.08 68.1,37.15 66.85,38.4 SD.CS v56.99,38.4 | R10.1 28.42,16.03 28.23,16.22 IC1.52 28.23,18.55 28.42,18.73 v28.42,19.53
  Bottom 0.203: v28.42,19.53 28.57,19.37 28.57,15.4 29.69,14.29 45.88,14.29 56.99,25.4 v56.99,38.4
SD_SCK  (via drill 0.3)
  Top 0.203: MSD.SCK 68.51,31.2 67.94,30.64 67.94,29.53 66.82,28.4 SD.SCK v56.2,28.4 | IC1.53 28.73,17.93 29.37,18.57 v29.37,19.05
  Bottom 0.203: v29.37,19.05 29.37,18.57 29.21,18.41 29.21,15.56 30,14.76 45.56,14.76 56.2,25.4 v56.2,28.4
SD_WP
  Top 0.203: IC1.24 30.73,29.3 31.75,30.32 WP.1
SPI_CS  (via drill 0.3)
  Top 0.203: IC1.50 27.23,18.01 26.67,18.57 26.67,19.53 27.46,20.32 29.53,20.32 v29.69,20.48 | R8.1 33.82,46.52 v34.13,46.83
  Bottom 0.203: v29.69,20.48 31.59,20.48 33.02,21.91 33.02,45.72 v34.13,46.83 40.64,53.34 J1.10
SPI_MISO/UART_BUSY  (via drill 0.3)
  Top 0.203: IC1.22 31.73,29.35 33.02,30.64 33.02,33.34 32.23,34.13 v30.32,34.13
  Bottom 0.203: v30.32,34.13 30.32,50.64 33.02,53.34 J1.7
SPI_MOSI  (via drill 0.3)
  Top 0.203: R9.1 30.48,47.31 v31.43,48.26 | IC1.23 31.23,27.42 v31.11,27.3
  Bottom 0.203: v31.11,27.3 31.43,27.62 v31.43,48.26 31.43,49.21 35.56,53.34 J1.8
SPI_SCK  (via drill 0.3)
  Top 0.203: IC1.55 29.73,17.98 30.48,18.73 30.48,22.07 28.89,23.65 28.89,24.13 29.69,24.92 31.43,24.92 v31.59,25.08
  Bottom 0.203: v31.59,25.08 32.23,25.72 32.23,47.47 38.1,53.34 J1.9
SU0
  Top 0.203: U1.S@2 10.1,20.54
  Top 0.406: 10.1,20.54 8.73,21.91 R21.1
  Bottom 0.406: U1.S@2 U1.S@1
SU1C  (4 unrouted)
  Top 0.203: 2.86,26 U2C.S@4 | 7.14,25.9 U2C.S@2
  Top 0.406: R23.1 7.14,25.9
  Bottom 0.254: U2C.S@6 U2C.S@7 U2C.S@4 U2C.S@2
SU1H
  Top 0.406: U2H.S@1 10.16,38.89 8.89,37.62 R22.1
  Bottom 0.406: U2H.S@2 U2H.S@1
SWCLK
  Top 0.203: IC1.49 26.73,16.57 24.13,13.97 SWD.SWCLK
SWDIO
  Top 0.203: IC1.46 25.45,20.11 25.72,19.84 25.72,18.1 22.86,15.24 SWD.SWDIO
TXO
  Top 0.203: FTDI.4-TXO 62.23,53.03 R5.2 R7.2
UART_RX/SPI_BUSY/I2C_BUSY  (via drill 0.3)
  Top 0.203: J1.4 25.4,54.61 26.67,53.34 52.07,53.34 56.2,49.21 61.44,49.21 62.39,50.16 R5.1 | IC1.43 26.53,21.61 26.99,22.07 v27.62,22.07
  Bottom 0.203: v27.62,22.07 27.62,51.75 25.4,53.98 J1.4
UART_TX/U1_CONNECT  (via drill 0.3)
  Top 0.203: J1.3 22.86,54.61 25.4,52.07 51.44,52.07 55.56,47.94 62.07,47.94 64.61,50.48 R4.1 | v26.35,25.88 26.83,25.4 26.83,22.7 26.24,22.11 IC1.42
  Bottom 0.203: v26.35,25.88 26.67,26.19 26.67,36.83 25.4,38.1 25.4,51.44 22.86,53.98 J1.3
USB0_N
  Top 0.203: R16.1 17.78,17.37 18.24,17.83 18.24,18.41 arc-90 20.86,21.04 24.07,21.04 24.14,21.11 IC1.44
USB0_P
  Top 0.203: R15.1 19.05,17.37 18.59,17.83 18.59,18.41 arc-90 20.86,20.68 24.07,20.68 24.14,20.61 IC1.45
USB1_N
  Top 0.203: R18.1 20.5,27 20.5,26.99 arc90 21.94,25.55 24.05,25.55 24.11,25.61 IC1.35
USB1_P
  Top 0.203: R17.1 20.14,27 20.14,26.99 arc90 21.94,25.19 24.05,25.19 24.13,25.11 IC1.36
VB
  Top 0.203: IC1.1 35.78,19.11 | D2.C 36.99,14.76 | 36.99,13.18 D1.C
  Top 0.254: 35.78,19.11 35.56,18.89 35.56,14.77 C18.2 D2.C | 36.99,14.76 36.99,13.18
VBAT
  Top 0.254: D2.A 40.32,14.76 42.86,12.22 42.86,10.09 BAT.+
VBUS_U0
  Top 0.406: U1.VBUS 13.61,22.18 F1.2
VBUS_U1C  (via drill 0.3)
  Top 0.406: U2C.VBUS 8.64,28.03 v8.73,27.94 8.73,26.19 10.48,24.45 F3.2 | U2C.VBUS2 8.66,32.93 v8.73,32.86
  Bottom 0.406: v8.73,32.86 8.26,32.86 7.62,32.23 7.62,28.57 8.26,27.94 v8.73,27.94
VBUS_U1H
  Top 0.406: F2.2 15.88,51.44 15.88,49.85 15.24,49.21 13.85,49.21 U2H.VBUS
VCAP1
  Top 0.254: IC1.31 27.23,29.6 26.99,29.84 C11.2
VCAP2
  Top 0.203: 22.95,19.61 C10.2
  Top 0.254: IC1.47 22.95,19.61
WAKEUP  (via drill 0.3)
  Top 0.203: IC1.14 34.87,25.61 v34.77,25.72
  Bottom 0.203: v34.77,25.72 35.24,26.19 35.24,27.78 34.61,28.42 34.61,43.02 45.72,54.13 J1.12

### Text on the board
Top: TOP
Bottom: BOT
tPlace: GND | 5V | RX | TX | GND | 5V | TX | RX | SDA | SCL | MISO | MOSI | SCK | CS | RDY | WKUP | RST | FTDI | U1 Host | CS MOSI Interf. | 5V | 3V3 | low low UART / low high Boot / high low I2C / high high SPI | U1 | MOSI | CS | Low High | Low High | U1 / Client | U1 | CD | WP | M | U1C | Client Host | STM32F205 | 12MHz | 32.768KHz | CR1225 | U0 | SWDIO | SWCLK | RST | U0 Host | SWD | + | - | DevKit / v1.0 | 3V3 | GND | GND | GND
Reference: Silkscreen: 21 tPlace